# EasyEDA Pro project ProPrj_智能环境监测节点与设计_2026-04-18.epro

# Schematic Schematic1
Assembly Variant: Basic; Board Name: Board1; Create Date: 2026-04-17; Page Name: P1; Project Name: 智能环境监测节点与设计; Schematic Name: Schematic1; Update Date: 2026-04-17; BladeWidth: 10; Company: 嘉立创EDA; Page Size: A4; RegionStart: 1; ShowBorder: 1; TitleBlock: 1; TitleBlockPosition: 3; Version: V1.0; XRegionCount: 6; YRegionCount: 4
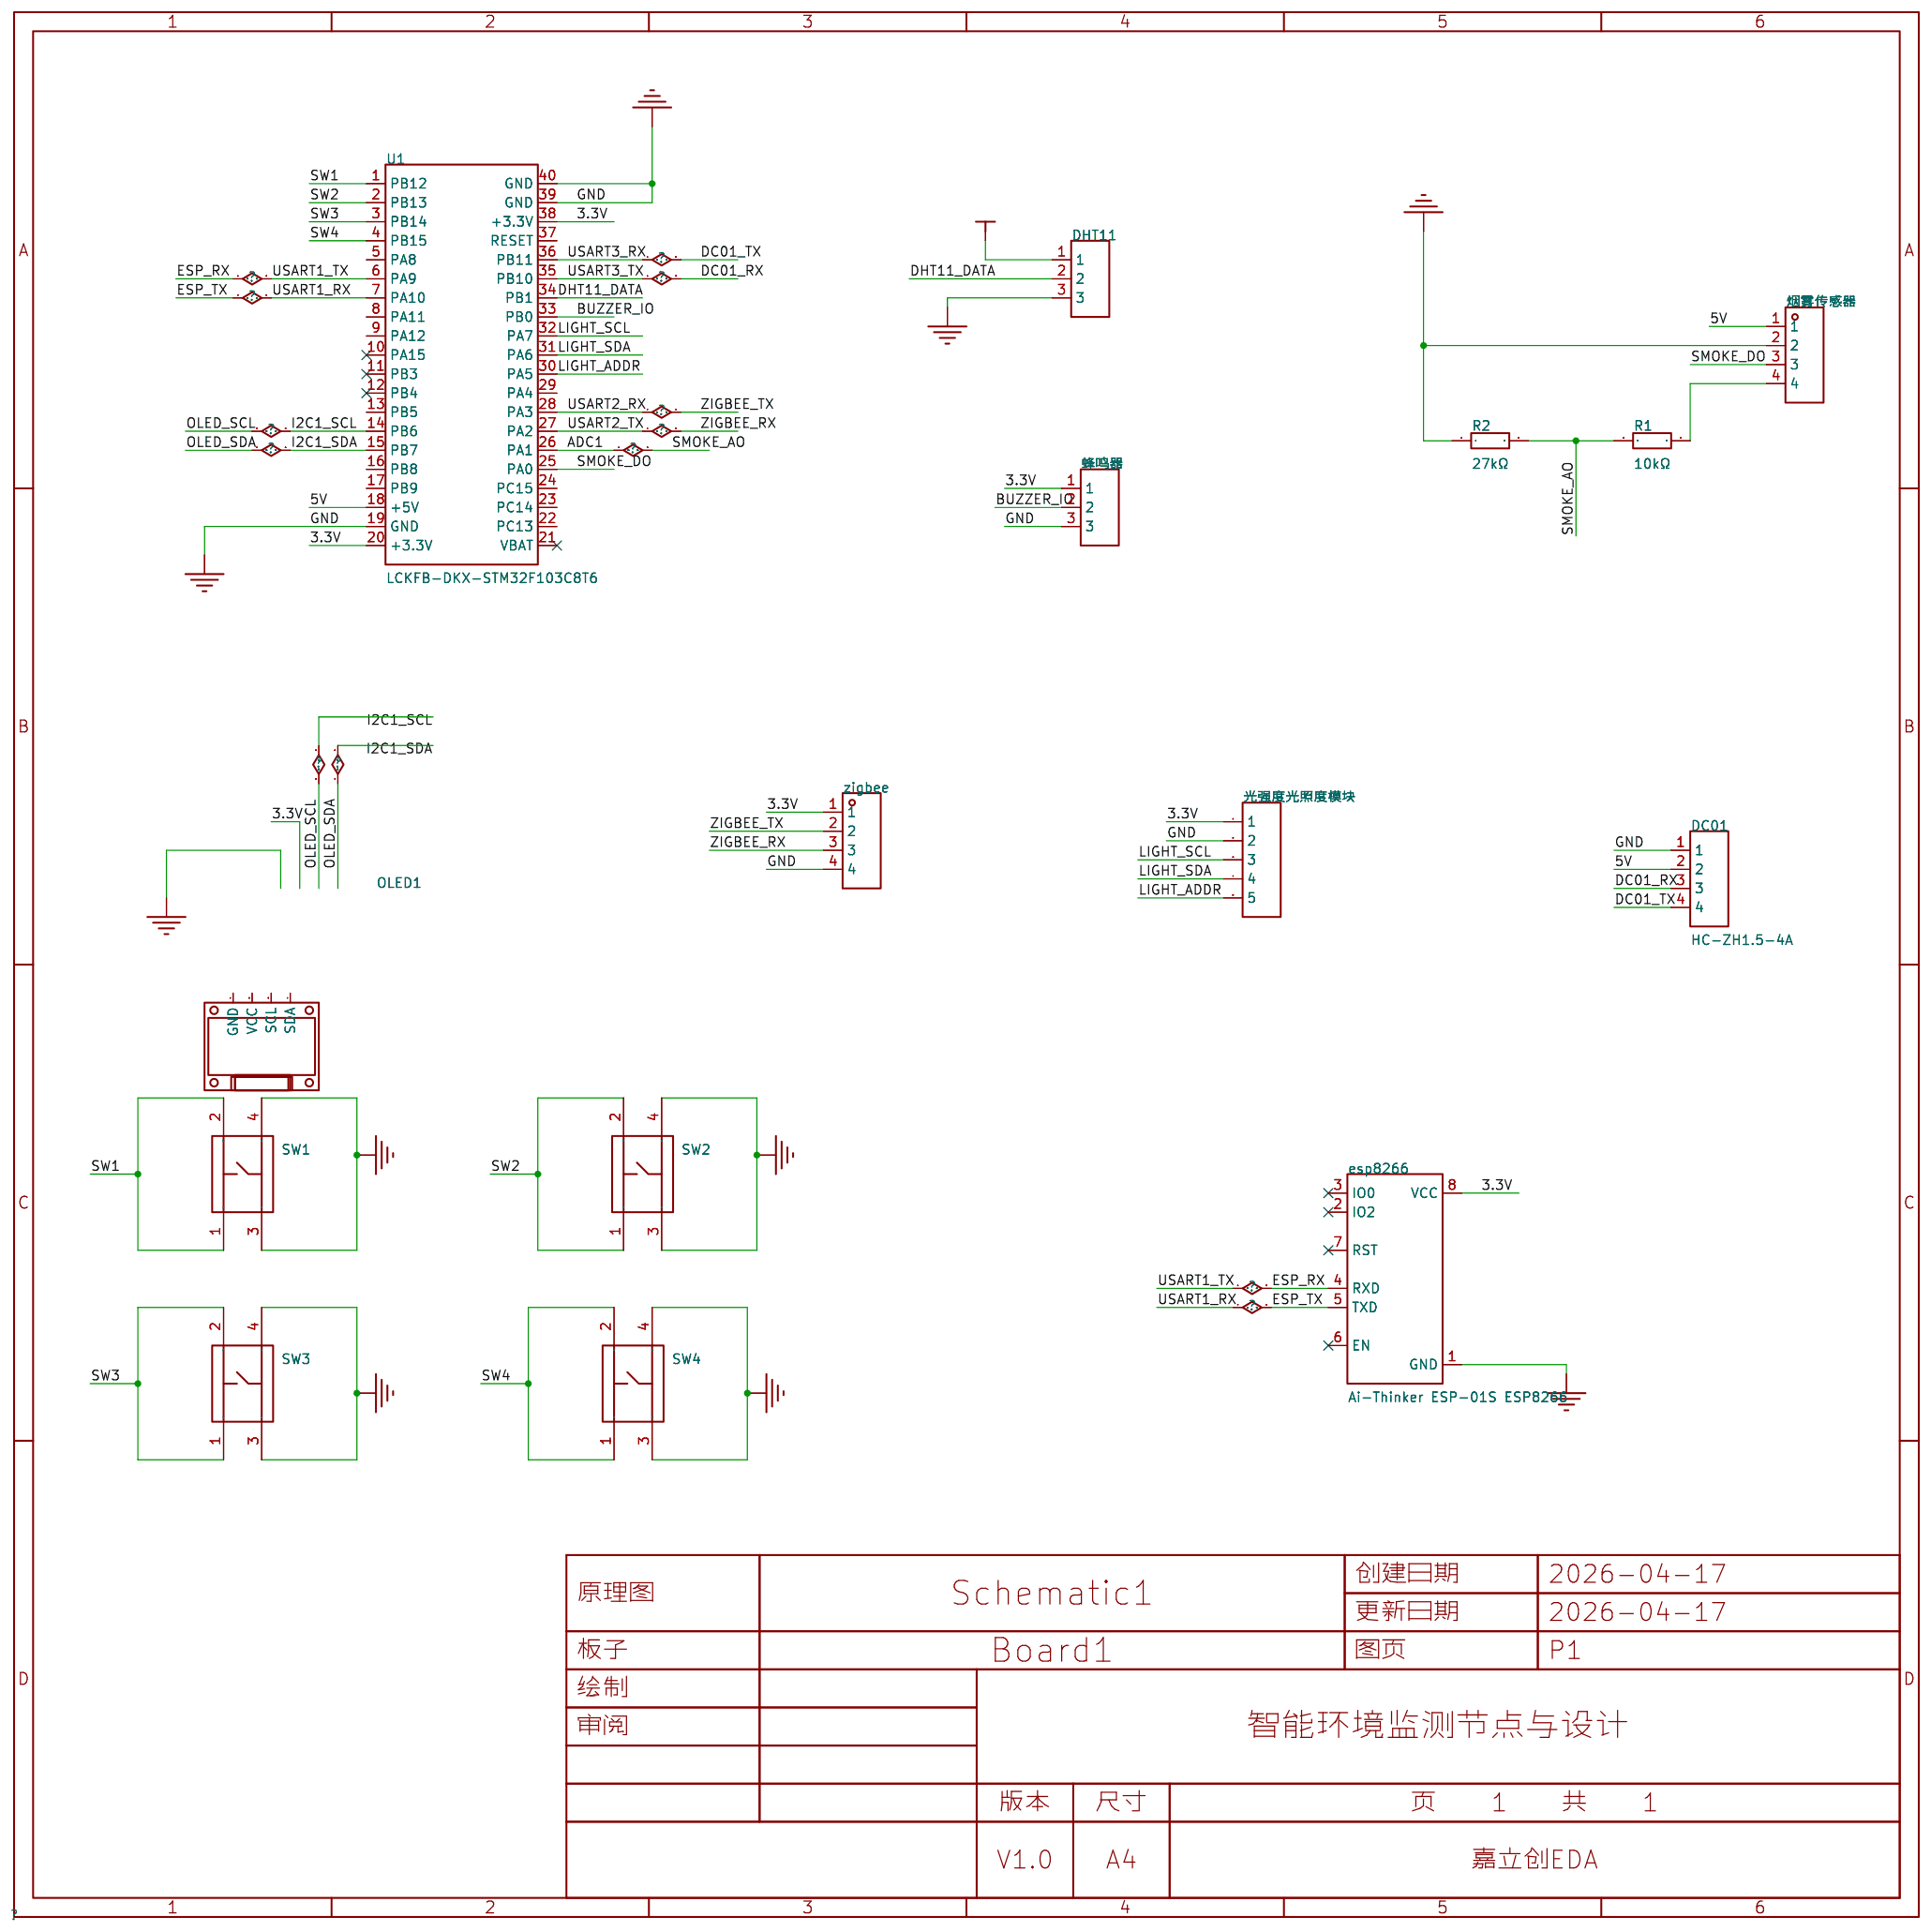
[diagram p0: schematic sheet]

## Parts
DC01  HC-ZH1.5-4A  [CONN-TH_4P-P1.50_HCTL_HC-ZH1.5-4A]
DHT11  -  [HDR-TH_3P-P2.54-V-F]
esp8266  Ai-Thinker ESP-01S ESP8266  [WIFIM-TH_8P-L24.7-W14.4-P2.54]
OLED1  -  [0.96OLED_4P]
R1  10kΩ  [R0805]
R2  27kΩ  [R0805]
SW1  K2-1102DP-C4SW-04  [KEY-TH_4P-L6.0-W6.0-P4.50-LS6.50]
SW2  K2-1102DP-C4SW-04  [KEY-TH_4P-L6.0-W6.0-P4.50-LS6.50]
SW3  K2-1102DP-C4SW-04  [KEY-TH_4P-L6.0-W6.0-P4.50-LS6.50]
SW4  K2-1102DP-C4SW-04  [KEY-TH_4P-L6.0-W6.0-P4.50-LS6.50]
U1  LCKFB-DKX-STM32F103C8T6  [CONN-TH_L53.3-W22.9_STM32F103C8T6-CARD]
zigbee  -  [HDR-TH_4P-P2.54-V-F]
光强度光照度模块  -  [HDR-TH_5P-P2.54-V-F]
烟雾传感器  -  [HDR-TH_4P-P2.54-V-F]
蜂鸣器  -  [HDR-TH_3P-P2.54-V-F]

## Library data of the parts
DC01 = HC-ZH1.5-4A: 插针结构:1x4P;间距:1.5mm;安装方式:直插;参考系列:ZH;总PIN数:4P;排数:1;每排PIN数:4;行距:-;额定电流:1A;触头材质:黄铜;触头镀层:锡;工作温度:-25℃~+85℃;; LCSC Part Name: 1x4P 间距:1.5mm 直插 系列:ZH; Supplier Part: C2845552; Manufacturer: HCTL(华灿天禄); Supplier Footprint: 插件,P=1.5mm; JLCPCB Part Class: Extended Part; Datasheet: https://item.szlcsc.com/datasheet/HC-ZH1.5-4A/3039233.html; Supplier: LCSC; Pins Structure: 1x4P; Pitch: 1.5mm; Mounting Type: 直插; Reference Series: ZH; Number of Pins: 4P; Number of Rows: 1; Number of PINs Per Row: 4; Current Rating: 1A; Contact Material: 黄铜; Contact Plating: 锡; Operating Temperature: -25℃~+85℃; Voltage Rating: 100V; Plastic Material: PBT; Flame Retardant Rating: UL94V-0; Z-Height of the Board: 4.5mm; X-Length of Bottom Edge on Board (Spacing Line): 7.5mm; Y-Width of Bottom Edge on Board: 3.6mm
DHT11 蜂鸣器 = HDR-F_2.54_1x3P: Supplier Part: C541850; Supplier Footprint: 插件
esp8266 = Ai-Thinker ESP-01S ESP8266: Supplier Part: C17606792; Manufacturer: Ai-Thinker(安信可); JLCPCB Part Class: Extended Part; Datasheet: https://item.szlcsc.com/datasheet/Ai-Thinker%2520ESP-01S%2520ESP8266/18736031.html; Supplier: LCSC
OLED1 = 0.96OLED模块_4P: Supplier Footprint: 插件
R1 R2 = 0805W8F1002T5E_C17414: 电阻类型:厚膜电阻;阻值:10kΩ;精度:±1%;功率:125mW;工作电压:150V;温度系数:±100ppm/℃;; LCSC Part Name: 10kΩ ±1% 125mW 厚膜电阻; Supplier Part: C17414; Manufacturer: UNI-ROYAL(厚声); Manufacturer Part: 0805W8F1002T5E; Supplier Footprint: 0805; JLCPCB Part Class: Basic Part; Datasheet: https://item.szlcsc.com/datasheet/0805W8F1002T5E/18102.html; Supplier: LCSC; Type: 厚膜电阻; Tolerance: ±1%; Power(Watts): 125mW; Voltage-Supply(Max): 150V; Temperature Coefficient: ±100ppm/℃; Operating Temperature: -55℃~+155℃
SW1-SW4 = K2-1102DP-C4SW-04: 电路结构:单刀单掷;按钮形状:圆形按钮;作用力:2.5N;安装方式:直插;开关长度:6mm;开关宽度:6mm;开关高度:5mm;触点电流:50mA;额定电压:12V;带灯:-;工作寿命:10万次;; LCSC Part Name: 轻触按键开关6*6*5; Supplier Part: C110153; Manufacturer: 韩国韩荣; Supplier Footprint: 插件-4P,6x6mm; JLCPCB Part Class: Extended Part; Datasheet: https://item.szlcsc.com/datasheet/K2-1102DP-C4SW-04/111374.html; Supplier: LCSC; Circuit: 单刀单掷; Actuator Style: 圆形按钮; Operating Force: 2.5N; Mounting Type: 直插; Length: 6mm; Width: 6mm; Switch Height: 5mm; Contact Current: 50mA; Voltage Rating: 12V; Life: 10万次; Operating Temperature: -25℃~+85℃
U1 = LCKFB-DKX-STM32F103C8T6: 搭载Contex M3内核,程序存储容量64KB,RAM总容量20KB,最高72MHz主频,提供高效的计算能力和稳定的运行环境。; LCSC Part Name: 立创·地阔星-STM32F103C8T6开发板; Supplier Part: C22396880; Manufacturer: 立创开发板; JLCPCB Part Class: Extended Part; Datasheet: https://item.szlcsc.com/datasheet/LCKFB-DKX-STM32F103C8T6/24005615.html; Supplier: LCSC
zigbee 烟雾传感器 = HDR-F_2.54_1x4P: Supplier Part: C2718488; Supplier Footprint: 插件
光强度光照度模块 = HDR-F_2.54_1x5P: Supplier Part: C50950; Supplier Footprint: 插件

## Nets
3.3V: DHT11.1 esp8266.8(VCC) U1.20(+3.3V) U1.38(+3.3V) zigbee.1 光强度光照度模块.1 蜂鸣器.1
5V: DC01.2 U1.18(+5V) 烟雾传感器.1
GND: DC01.1 DHT11.3 esp8266.1(GND) R2.1 SW1.3 SW1.4 SW2.3 SW2.4 SW3.3 SW3.4 SW4.3 SW4.4 U1.19(GND) U1.39(GND) U1.40(GND) zigbee.4 光强度光照度模块.2 烟雾传感器.2 蜂鸣器.3
ADC1: R1.1 R2.2 U1.26(PA1)
BUZZER_IO: U1.33(PB0) 蜂鸣器.2
DC01_RX: DC01.3 U1.35(PB10)
DC01_TX: DC01.4 U1.36(PB11)
DHT11_DATA: DHT11.2 U1.34(PB1)
ESP_RX: esp8266.4(RXD) U1.6(PA9)
ESP_TX: esp8266.5(TXD) U1.7(PA10)
I2C1_SCL: U1.14(PB6)
I2C1_SDA: U1.15(PB7)
LIGHT_ADDR: U1.30(PA5) 光强度光照度模块.5
LIGHT_SCL: U1.32(PA7) 光强度光照度模块.3
LIGHT_SDA: U1.31(PA6) 光强度光照度模块.4
SMOKE_DO: U1.25(PA0) 烟雾传感器.3
SW1: SW1.1 SW1.2 U1.1(PB12)
SW2: SW2.1 SW2.2 U1.2(PB13)
SW3: SW3.1 SW3.2 U1.3(PB14)
SW4: SW4.1 SW4.2 U1.4(PB15)
USART2_RX: U1.28(PA3) zigbee.2
USART2_TX: U1.27(PA2) zigbee.3
$1N46: R1.2 烟雾传感器.4

Not connected (* = marked no-connect by the designer): esp8266 2(IO2)* 3(IO0)* 6(EN)* 7(RST)*; OLED1 1(GND) 2(VCC) 3(SCL) 4(SDA); U1 5(PA8) 8(PA11) 9(PA12) 10(PA15)* 11(PB3)* 12(PB4)* 13(PB5) 16(PB8) 17(PB9) 21(VBAT)* 22(PC13) 23(PC14) 24(PC15) 29(PA4) 37(RESET)

# Board PCB1
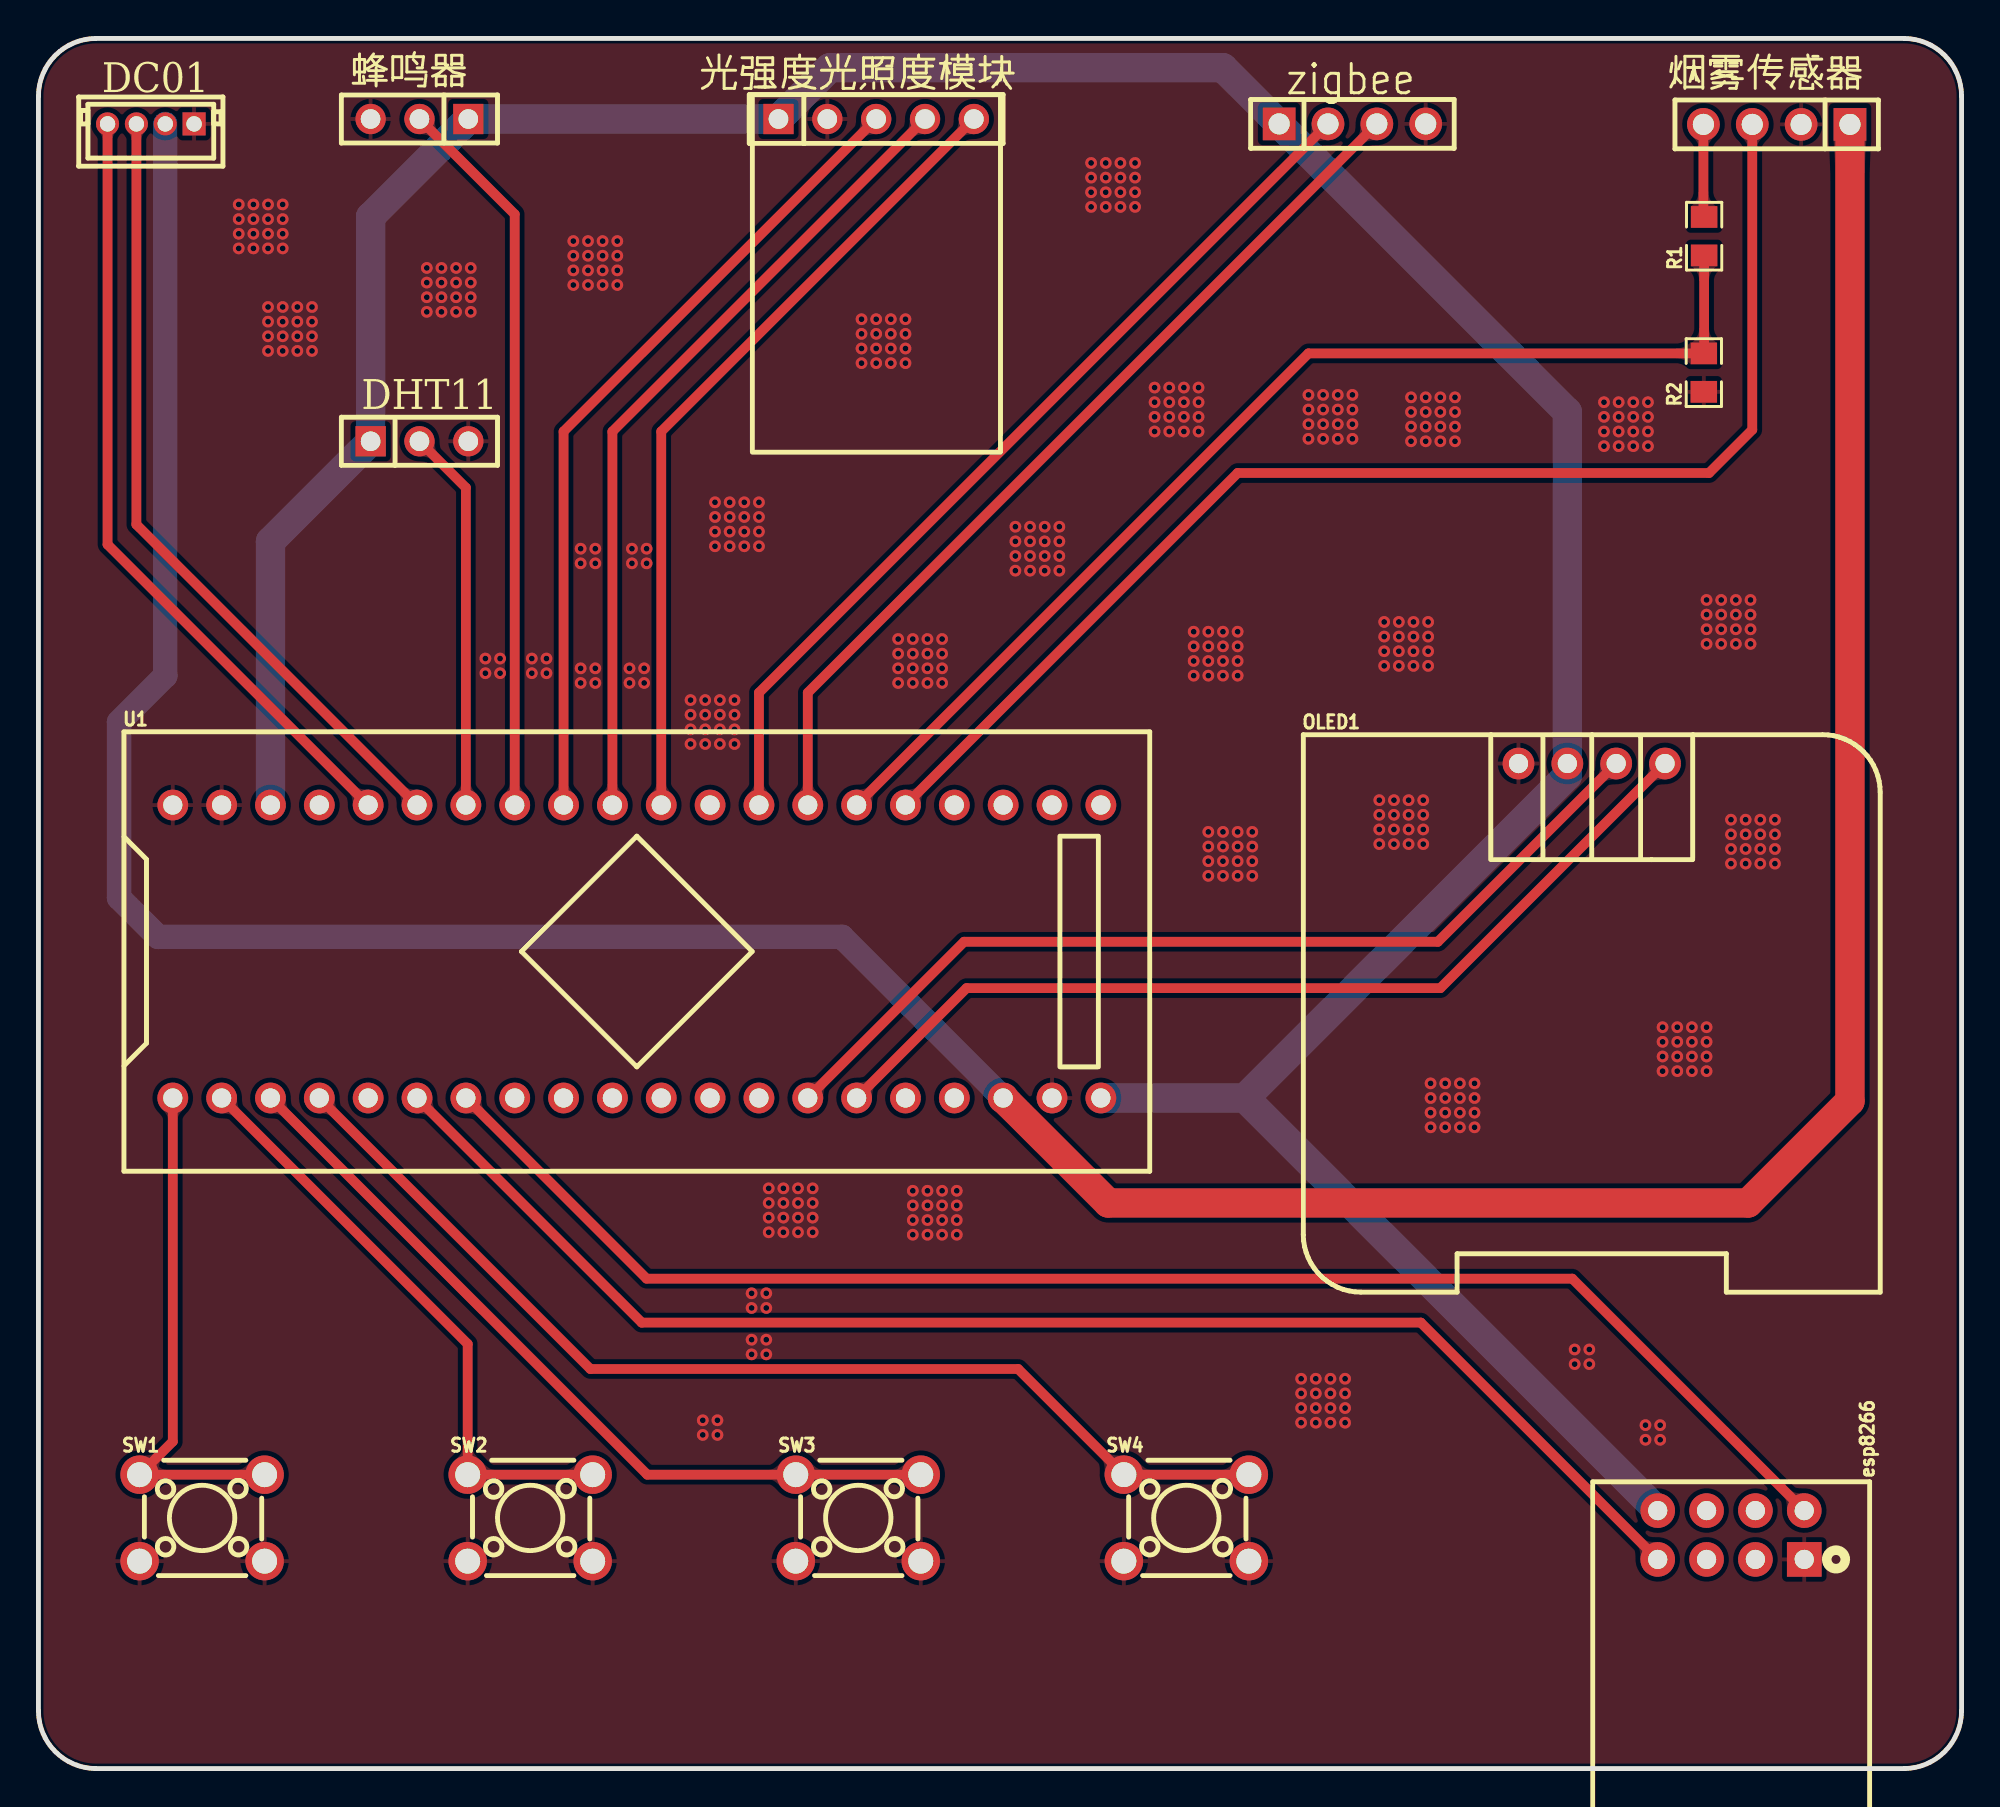
[diagram p1: board, top side]
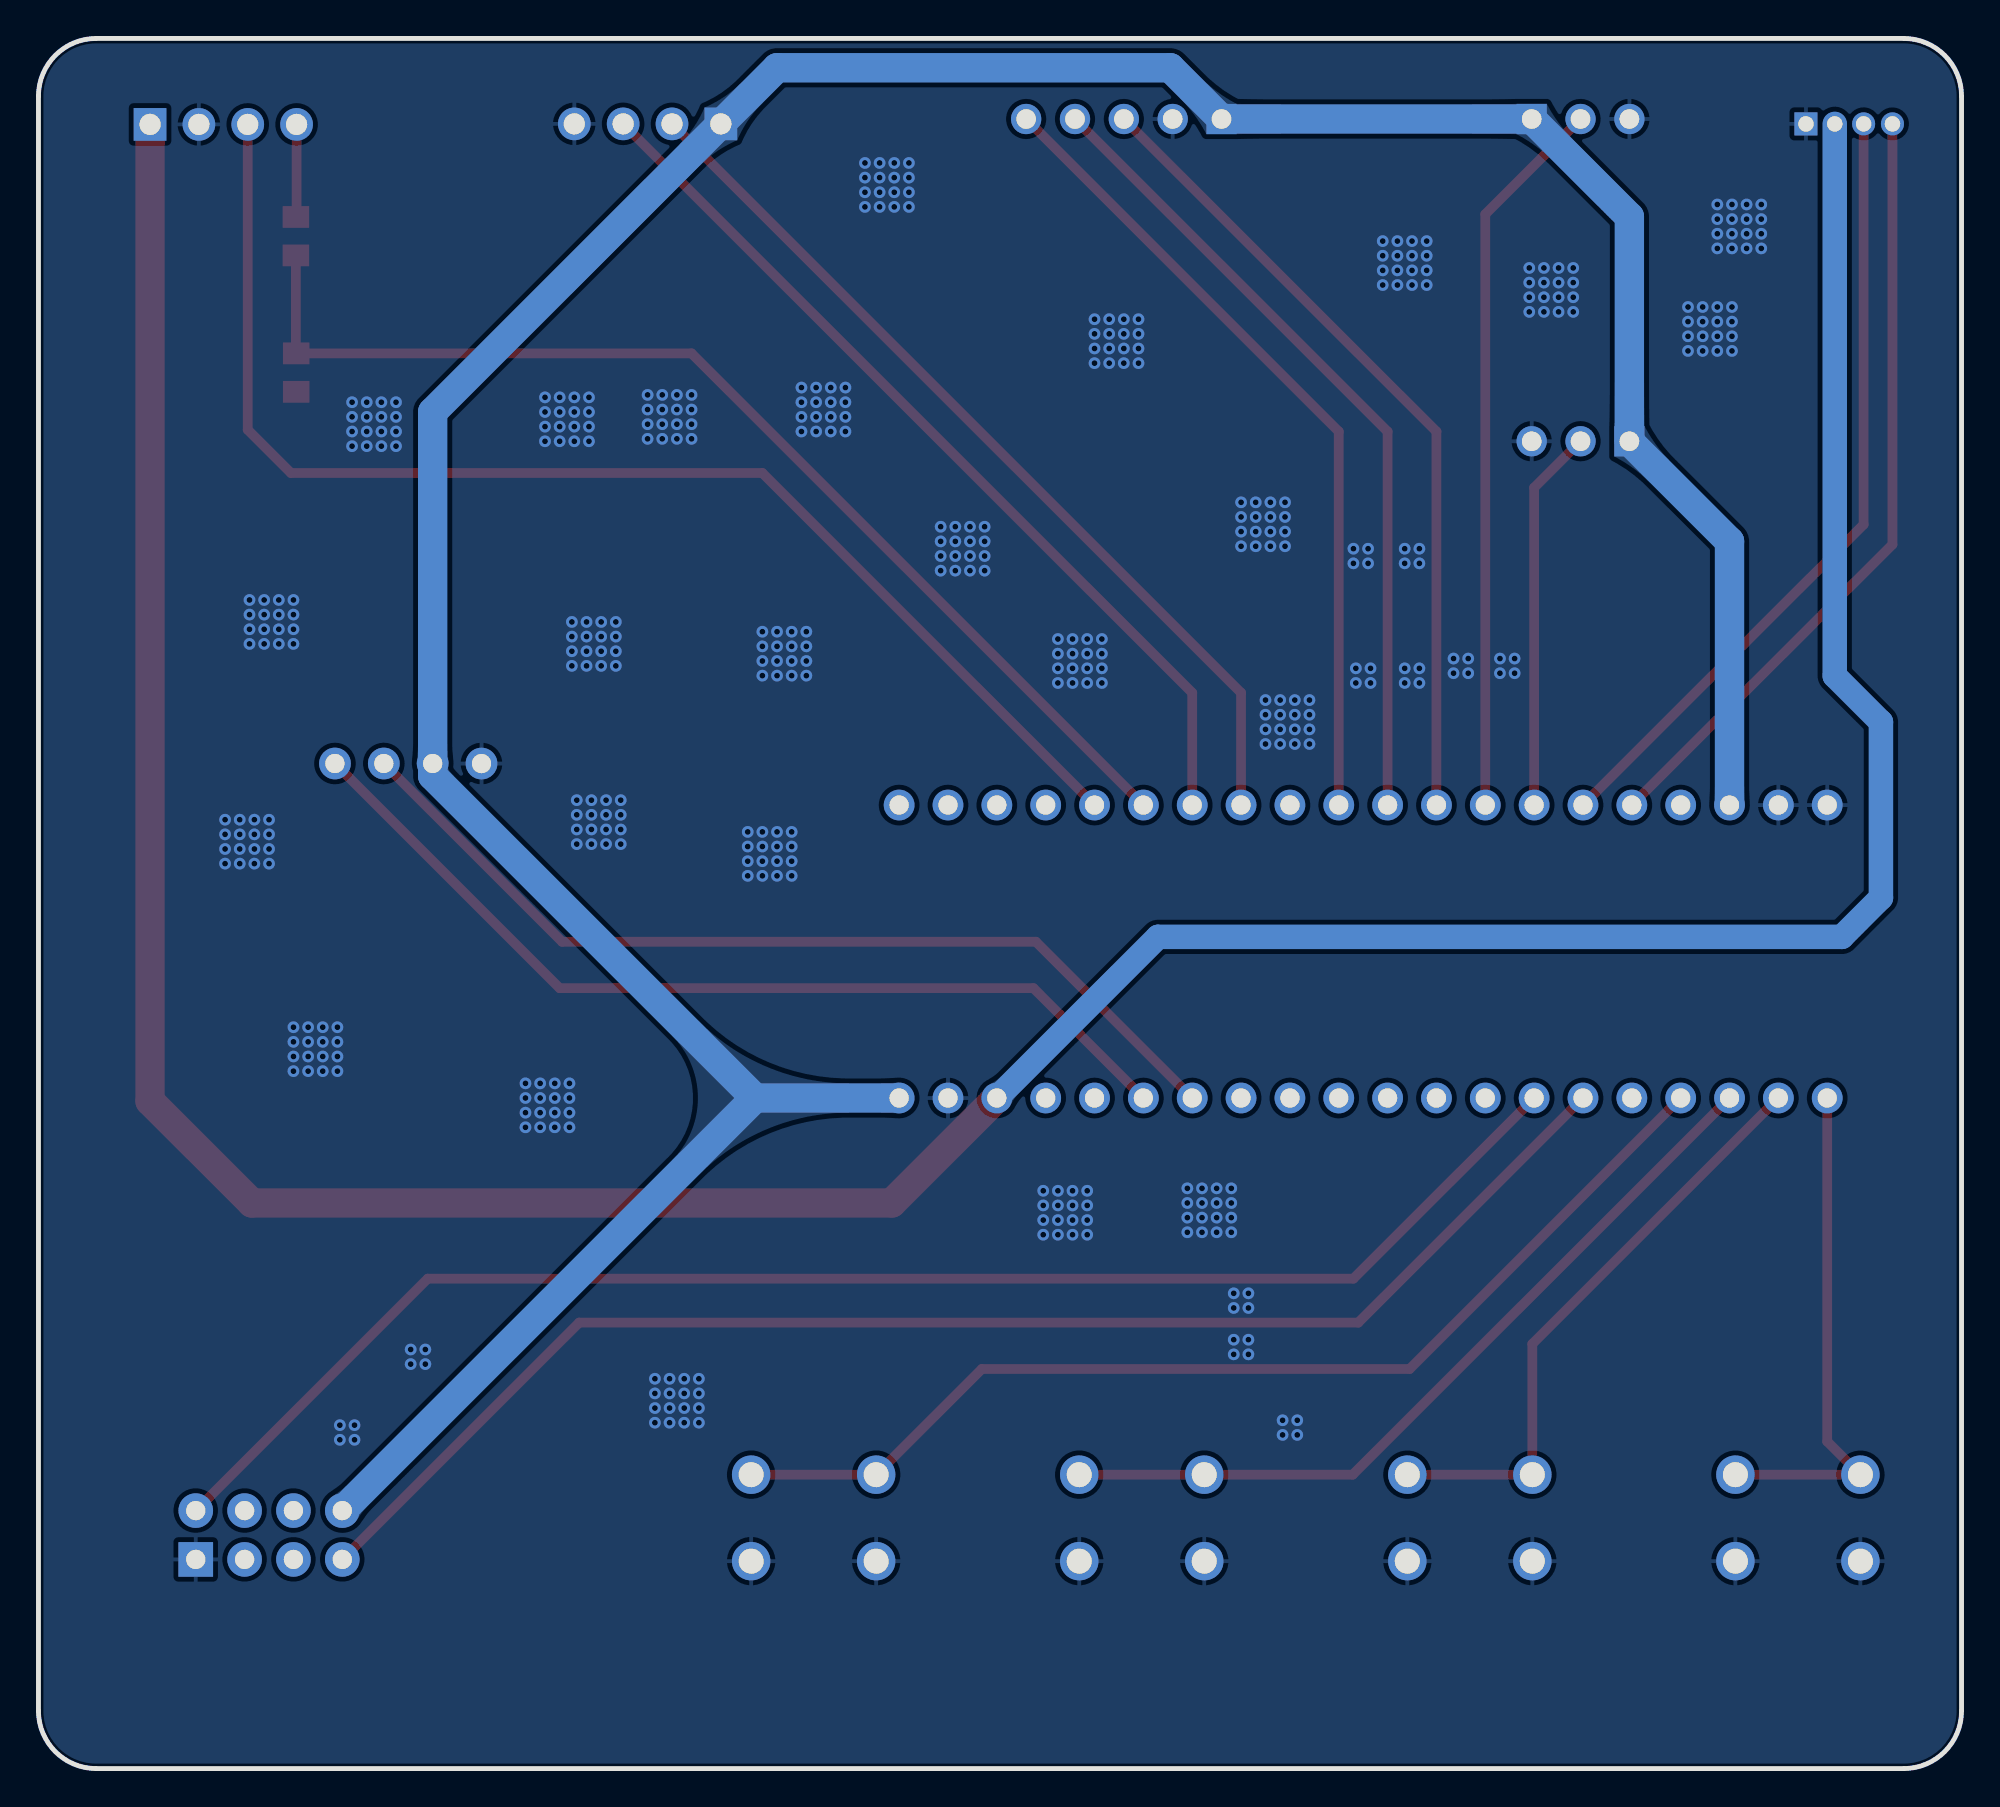
[diagram p2: board, bottom side, seen from below]

Outline 100 x 90 mm; copper layers: Top Layer, Bottom Layer. Coordinates in mm from the lower left corner of the outline.
Outline path: 0,87 0,3 arc(0.88,0.88) 3,0 97,0 arc(99.12,0.88) 100,3 100,87 arc(99.12,89.12) 97,90 3,90 arc(0.88,89.12) 0,87
Stack: Top Layer 0.035mm / Dielectric1 1.51mm FR4 er 4.5 / Bottom Layer 0.035mm

## Design rules (mm)
spacing copperThickness1oz (default): track to track 0.102, other pairs 0.152 to 0.3
spacing copperThickness2oz: track to track 0.203, other pairs 0.152 to 0.3
track width copperThickness1oz (default): min 0.127, default 0.254, max 2.54
track width copperThickness2oz: min 0.203, default 0.254, max 2.54
differential pair differentialPair (default): width min 0.127, default 0.254, max 2.54; gap min 0.152, default 0.152
net GND uses copperRegion

## Placement (name value [footprint] x y rotation side)
DC01  HC-ZH1.5-4A  [CONN-TH_4P-P1.50_HCTL_HC-ZH1.5-4A]  5.84 85.56 180 top
DHT11  -  [HDR-TH_3P-P2.54-V-F]  19.81 69.05 0 top
esp8266  Ai-Thinker ESP-01S ESP8266  [WIFIM-TH_8P-L24.7-W14.4-P2.54]  88.01 12.15 270 top
OLED1  -  [0.96OLED_4P]  80.77 52.28 0 top
R1  10kΩ  [R0805]  86.61 79.71 90 top
R2  27kΩ  [R0805]  86.6 72.62 90 top
SW1  K2-1102DP-C4SW-04  [KEY-TH_4P-L6.0-W6.0-P4.50-LS6.50]  8.51 13.04 0 top
SW2  K2-1102DP-C4SW-04  [KEY-TH_4P-L6.0-W6.0-P4.50-LS6.50]  25.57 13.04 0 top
SW3  K2-1102DP-C4SW-04  [KEY-TH_4P-L6.0-W6.0-P4.50-LS6.50]  42.63 13.04 0 top
SW4  K2-1102DP-C4SW-04  [KEY-TH_4P-L6.0-W6.0-P4.50-LS6.50]  59.69 13.04 0 top
U1  LCKFB-DKX-STM32F103C8T6  [CONN-TH_L53.3-W22.9_STM32F103C8T6-CARD]  31.12 42.5 0 top
zigbee  -  [HDR-TH_4P-P2.54-V-F]  68.33 85.56 0 top
光强度光照度模块  -  [HDR-TH_5P-P2.54-V-F]  43.56 85.81 0 top
烟雾传感器  -  [HDR-TH_4P-P2.54-V-F]  90.39 85.53 180 top
蜂鸣器  -  [HDR-TH_3P-P2.54-V-F]  19.81 85.81 180 top

## Footprints (pads in the part's own frame, mm; a bottom-side part is the same pattern mirrored in y, then rotated)
0.96OLED_4P
  round 1.65 hole 1: 1(-3.81,-0.002) 2(-1.27,0.002) 3(1.27,0.002) 4(3.81,0.002)
CONN-TH_4P-P1.50_HCTL_HC-ZH1.5-4A
  rect 1.2x1.2 hole 0.8: 1(-2.25,0)
  round 1.2 hole 0.8: 2(-0.75,0) 3(0.75,0) 4(2.25,0)
CONN-TH_L53.3-W22.9_STM32F103C8T6-CARD
  round 1.6 hole 1: 1(-24.13,-7.62) 2(-21.59,-7.62) 3(-19.05,-7.62) 4(-16.51,-7.62) 5(-13.97,-7.62) 6(-11.43,-7.62) 7(-8.89,-7.62) 8(-6.35,-7.62) 9(-3.81,-7.62) 10(-1.27,-7.62) 11(1.27,-7.62) 12(3.81,-7.62) 13(6.35,-7.62) 14(8.89,-7.62) 15(11.43,-7.62) 16(13.97,-7.62) 17(16.51,-7.62) 18(19.05,-7.62) 19(21.59,-7.62) 20(24.13,-7.62) 21(24.13,7.62) 22(21.59,7.62) 23(19.05,7.62) 24(16.51,7.62) 25(13.97,7.62) 26(11.43,7.62) 27(8.89,7.62) 28(6.35,7.62) 29(3.81,7.62) 30(1.27,7.62) 31(-1.27,7.62) 32(-3.81,7.62) 33(-6.35,7.62) 34(-8.89,7.62) 35(-11.43,7.62) 36(-13.97,7.62) 37(-16.51,7.62) 38(-19.05,7.62) 39(-21.59,7.62) 40(-24.13,7.62)
HDR-TH_3P-P2.54-V-F
  rect 1.575x1.575 hole 1.02: 1(-2.54,0)
  round 1.575 hole 1.02: 2(0,0) 3(2.54,0)
HDR-TH_4P-P2.54-V-F
  rect 1.7x1.7 hole 1.1: 1(-3.81,0)
  round 1.7 hole 1.1: 2(-1.27,0) 3(1.27,0) 4(3.81,0)
HDR-TH_5P-P2.54-V-F
  rect 1.575x1.575 hole 1.02: 1(-5.08,0)
  round 1.575 hole 1.02: 2(-2.54,0) 3(0,0) 4(2.54,0) 5(5.08,0)
KEY-TH_4P-L6.0-W6.0-P4.50-LS6.50
  round 2 hole 1.3: 1(-3.25,2.25) 2(3.25,2.25) 3(-3.25,-2.25) 4(3.25,-2.25)
R0805
  rect 1.133x1.377 smd: 1(-1,0) 2(1,0)
WIFIM-TH_8P-L24.7-W14.4-P2.54
  rect 1.8x1.8 hole 1: 1(1.27,3.81)
  round 1.8 hole 1: 2(1.27,1.27) 3(1.27,-1.27) 4(1.27,-3.81) 5(-1.27,3.81) 6(-1.27,1.27) 7(-1.27,-1.27) 8(-1.27,-3.81)

## Nets
As in the schematic, except:
3.3V: DHT11.1 esp8266.8 OLED1.2 U1.20 U1.38 zigbee.1 光强度光照度模块.1 蜂鸣器.1
GND: DC01.1 DHT11.3 esp8266.1 OLED1.1 R2.1 SW1.3 SW1.4 SW2.3 SW2.4 SW3.3 SW3.4 SW4.3 SW4.4 U1.19 U1.39 U1.40 zigbee.4 光强度光照度模块.2 烟雾传感器.2 蜂鸣器.3
I2C1_SCL: OLED1.3 U1.14
I2C1_SDA: OLED1.4 U1.15

Pads without a net: esp8266 2 3 6 7; U1 5 8 9 10 11 12 13 16 17 21 22 23 24 29 37

## Via types
v1: diameter 0.61, hole 0.305, Top Layer to Bottom Layer, 444 vias

## Routing (per net, layer and track width the routed paths; a pad name or vN(x,y) marks a point on that pad's centre or on a via; arc(x,y) is an arc through that point)
3.3V: length 186.1
  Bottom Layer w1.524: U1.20 62.74,34.88 ; 62.74,34.88 79.5,51.65 OLED1.2 79.5,70.57 zigbee.1 61.59,88.48 41.15,88.48 光强度光照度模块.1 蜂鸣器.1 17.27,80.73 DHT11.1 12.06,63.84 12.06,50.12 ; 62.74,34.88 esp8266.8
5V: length 190.8
  Top Layer w1.524: 烟雾传感器.1 94.2,34.72 88.9,29.42 55.63,29.42 50.16,34.88
  Bottom Layer w1.27: DC01.2 6.59,56.84 4.19,54.44 4.19,45.3 6.22,43.26 41.78,43.26 50.16,34.88
GND:
  vias: v1(10.41,81.36) v1(10.41,80.6) v1(10.41,79.84) v1(10.41,79.08) v1(11.18,81.36) v1(11.18,80.6) v1(11.18,79.84) v1(11.18,79.08) v1(11.94,81.36) v1(11.94,80.6) v1(11.94,79.84) v1(11.94,79.08) v1(11.94,76.03) v1(11.94,75.27) v1(11.94,74.51) v1(11.94,73.74) v1(12.7,81.36) v1(12.7,80.6) v1(12.7,79.84) v1(12.7,79.08) v1(12.7,76.03) v1(12.7,75.27) v1(12.7,74.51) v1(12.7,73.74) v1(13.46,76.03) v1(13.46,75.27) v1(13.46,74.51) v1(13.46,73.74) v1(14.22,76.03) v1(14.22,75.27) v1(14.22,74.51) v1(14.22,73.74) v1(20.19,78.06) v1(20.19,77.3) v1(20.19,76.54) v1(20.19,75.78) v1(20.95,78.06) v1(20.96,77.3) v1(20.95,76.54) v1(20.96,75.78) v1(21.72,78.06) v1(21.72,77.3) v1(21.72,76.54) v1(21.72,75.78) v1(22.48,78.06) v1(22.48,77.3) v1(22.48,76.54) v1(22.48,75.78) v1(23.24,57.74) v1(23.24,56.98) v1(24,57.74) v1(24,56.98) v1(25.65,57.74) v1(25.65,56.98) v1(26.42,57.74) v1(26.42,56.98) v1(27.81,79.46) v1(27.81,78.7) v1(27.81,77.94) v1(27.81,77.17) v1(28.19,63.46) v1(28.19,62.69) v1(28.19,57.23) v1(28.19,56.47) v1(28.57,79.46) v1(28.58,78.7) v1(28.57,77.94) v1(28.58,77.17) v1(28.96,63.46) v1(28.96,62.69) v1(28.96,57.23) v1(28.96,56.47) v1(29.34,79.46) v1(29.34,78.7) v1(29.34,77.94) v1(29.34,77.17) v1(30.1,79.46) v1(30.1,78.7) v1(30.1,77.94) v1(30.1,77.17) v1(30.73,57.23) v1(30.73,56.47) v1(30.86,63.46) v1(30.86,62.69) v1(31.5,57.23) v1(31.5,56.47) v1(31.62,63.46) v1(31.62,62.69) v1(33.91,55.58) v1(33.91,54.82) v1(33.91,54.06) v1(33.91,53.3) v1(34.54,18.12) v1(34.54,17.36) v1(34.67,55.58) v1(34.67,54.82) v1(34.67,54.06) v1(34.67,53.3) v1(35.18,65.87) v1(35.18,65.11) v1(35.18,64.35) v1(35.18,63.58) v1(35.31,18.12) v1(35.31,17.36) v1(35.43,55.58) v1(35.43,54.82) v1(35.43,54.06) v1(35.43,53.3) v1(35.94,65.87) v1(35.94,65.11) v1(35.94,64.35) v1(35.94,63.58) v1(36.19,55.58) v1(36.2,54.82) v1(36.19,54.06) v1(36.2,53.3) v1(36.7,65.87) v1(36.7,65.11) v1(36.7,64.35) v1(36.7,63.58) v1(37.08,24.72) v1(37.08,23.96) v1(37.08,22.31) v1(37.08,21.55) v1(37.46,65.87) v1(37.47,65.11) v1(37.46,64.35) v1(37.47,63.58) v1(37.85,24.72) v1(37.85,23.96) v1(37.85,22.31) v1(37.85,21.55) v1(37.97,30.18) v1(37.97,29.42) v1(37.97,28.66) v1(37.97,27.9) v1(38.74,30.18) v1(38.74,29.42) v1(38.73,28.66) v1(38.74,27.9) v1(39.5,30.18) v1(39.5,29.42) v1(39.5,28.66) v1(39.5,27.9) v1(40.26,30.18) v1(40.26,29.42) v1(40.26,28.66) v1(40.26,27.9) v1(42.8,75.39) v1(42.8,74.63) v1(42.8,73.87) v1(42.8,73.11) v1(43.56,75.39) v1(43.56,74.63) v1(43.56,73.87) v1(43.56,73.11) v1(44.32,75.39) v1(44.32,74.63) v1(44.32,73.87) v1(44.32,73.11) v1(44.7,58.76) v1(44.7,58) v1(44.7,57.23) v1(44.7,56.47) v1(45.08,75.39) v1(45.09,74.63) v1(45.08,73.87) v1(45.09,73.11) v1(45.47,58.76) v1(45.47,58) v1(45.47,57.23) v1(45.47,56.47) v1(45.47,30.06) v1(45.47,29.29) v1(45.47,28.53) v1(45.47,27.77) v1(46.23,58.76) v1(46.23,58) v1(46.23,57.23) v1(46.23,56.47) v1(46.23,30.06) v1(46.23,29.29) v1(46.23,28.53) v1(46.23,27.77) v1(46.99,58.76) v1(46.99,58) v1(46.99,57.23) v1(46.99,56.47) v1(46.99,30.06) v1(46.99,29.29) v1(46.99,28.53) v1(46.99,27.77) v1(47.75,30.06) v1(47.75,29.29) v1(47.75,28.53) v1(47.75,27.77) v1(50.8,64.6) v1(50.8,63.84) v1(50.8,63.08) v1(50.8,62.31) v1(51.56,64.6) v1(51.56,63.84) v1(51.56,63.08) v1(51.56,62.31) v1(52.32,64.6) v1(52.32,63.84) v1(52.32,63.08) v1(52.32,62.31) v1(53.09,64.6) v1(53.09,63.84) v1(53.09,63.08) v1(53.09,62.31) v1(54.74,83.52) v1(54.74,82.76) v1(54.74,82) v1(54.74,81.24) v1(55.5,83.52) v1(55.5,82.76) v1(55.5,82) v1(55.5,81.24) v1(56.26,83.52) v1(56.26,82.76) v1(56.26,82) v1(56.26,81.24) v1(57.02,83.52) v1(57.02,82.76) v1(57.02,82) v1(57.02,81.24) v1(58.04,71.84) v1(58.04,71.08) v1(58.04,70.31) v1(58.04,69.55) v1(58.8,71.84) v1(58.8,71.08) v1(58.8,70.31) v1(58.8,69.55) v1(59.56,71.84) v1(59.56,71.08) v1(59.56,70.31) v1(59.56,69.55) v1(60.07,59.14) v1(60.07,58.38) v1(60.07,57.61) v1(60.07,56.85) v1(60.32,71.84) v1(60.33,71.08) v1(60.32,70.31) v1(60.33,69.55) v1(60.83,59.14) v1(60.83,58.38) v1(60.83,57.61) v1(60.83,56.85) v1(60.83,48.72) v1(60.83,47.96) v1(60.83,47.2) v1(60.83,46.44) v1(61.59,59.14) v1(61.59,58.38) v1(61.59,57.61) v1(61.59,56.85) v1(61.59,48.72) v1(61.6,47.96) v1(61.59,47.2) v1(61.6,46.44) v1(62.36,59.14) v1(62.36,58.38) v1(62.36,57.61) v1(62.36,56.85) v1(62.36,48.72) v1(62.36,47.96) v1(62.36,47.2) v1(62.36,46.44) v1(63.12,48.72) v1(63.12,47.96) v1(63.12,47.2) v1(63.12,46.44) v1(65.66,20.28) v1(65.66,19.51) v1(65.66,18.75) v1(65.66,17.99) v1(66.04,71.46) v1(66.04,70.7) v1(66.04,69.93) v1(66.04,69.17) v1(66.42,20.28) v1(66.42,19.51) v1(66.42,18.75) v1(66.42,17.99) v1(66.8,71.46) v1(66.8,70.7) v1(66.8,69.93) v1(66.8,69.17) v1(67.18,20.28) v1(67.18,19.51) v1(67.18,18.75) v1(67.18,17.99) v1(67.56,71.46) v1(67.56,70.7) v1(67.56,69.93) v1(67.56,69.17) v1(67.94,20.28) v1(67.95,19.51) v1(67.94,18.75) v1(67.95,17.99) v1(68.33,71.46) v1(68.33,70.7) v1(68.33,69.93) v1(68.33,69.17) v1(69.72,50.38) v1(69.72,49.61) v1(69.72,48.85) v1(69.72,48.09) v1(69.98,59.65) v1(69.98,58.89) v1(69.98,58.12) v1(69.98,57.36) v1(70.49,50.38) v1(70.49,49.61) v1(70.48,48.85) v1(70.49,48.09) v1(70.74,59.65) v1(70.74,58.89) v1(70.74,58.12) v1(70.74,57.36) v1(71.25,50.38) v1(71.25,49.61) v1(71.25,48.85) v1(71.25,48.09) v1(71.37,71.33) v1(71.37,70.57) v1(71.37,69.81) v1(71.37,69.05) v1(71.5,59.65) v1(71.5,58.89) v1(71.5,58.12) v1(71.5,57.36) v1(72.01,50.38) v1(72.01,49.61) v1(72.01,48.85) v1(72.01,48.09) v1(72.14,71.33) v1(72.14,70.57) v1(72.14,69.81) v1(72.14,69.05) v1(72.26,59.65) v1(72.26,58.89) v1(72.26,58.12) v1(72.26,57.36) v1(72.39,35.64) v1(72.39,34.88) v1(72.39,34.12) v1(72.39,33.36) v1(72.9,71.33) v1(72.9,70.57) v1(72.9,69.81) v1(72.9,69.05) v1(73.15,35.64) v1(73.15,34.88) v1(73.15,34.12) v1(73.15,33.36) v1(73.66,71.33) v1(73.66,70.57) v1(73.66,69.81) v1(73.66,69.05) v1(73.91,35.64) v1(73.91,34.88) v1(73.91,34.12) v1(73.91,33.36) v1(74.68,35.64) v1(74.68,34.88) v1(74.68,34.12) v1(74.68,33.36) v1(79.88,21.8) v1(79.88,21.04) v1(80.64,21.8) v1(80.65,21.04) v1(81.41,71.08) v1(81.41,70.31) v1(81.41,69.55) v1(81.41,68.79) v1(82.17,71.08) v1(82.17,70.31) v1(82.17,69.55) v1(82.17,68.79) v1(82.93,71.08) v1(82.93,70.31) v1(82.93,69.55) v1(82.93,68.79) v1(83.57,17.86) v1(83.57,17.1) v1(83.69,71.08) v1(83.69,70.31) v1(83.69,69.55) v1(83.69,68.79) v1(84.33,17.86) v1(84.33,17.1) v1(84.46,38.56) v1(84.46,37.8) v1(84.45,37.04) v1(84.45,36.28) v1(85.22,38.56) v1(85.22,37.8) v1(85.22,37.04) v1(85.22,36.28) v1(85.98,38.56) v1(85.98,37.8) v1(85.98,37.04) v1(85.98,36.28) v1(86.74,60.79) v1(86.74,60.03) v1(86.74,59.27) v1(86.74,58.5) v1(86.74,38.56) v1(86.74,37.8) v1(86.74,37.04) v1(86.74,36.28) v1(87.5,60.79) v1(87.5,60.03) v1(87.5,59.27) v1(87.5,58.5) v1(88.01,49.36) v1(88.01,48.6) v1(88.01,47.84) v1(88.01,47.07) v1(88.26,60.79) v1(88.26,60.03) v1(88.26,59.27) v1(88.26,58.5) v1(88.77,49.36) v1(88.77,48.6) v1(88.77,47.84) v1(88.77,47.07) v1(89.03,60.79) v1(89.03,60.03) v1(89.03,59.27) v1(89.03,58.5) v1(89.53,49.36) v1(89.53,48.6) v1(89.53,47.84) v1(89.53,47.07) v1(90.3,49.36) v1(90.3,48.6) v1(90.3,47.84) v1(90.3,47.07)
ADC1: length 58.9
  Top Layer w0.508: R1.1 86.61,73.63 R2.2 66.04,73.62 42.54,50.12
BUZZER_IO: length 37.7
  Top Layer w0.508: 24.77,50.12 24.77,80.86 蜂鸣器.2
DC01_RX: length 41.5
  Top Layer w0.508: U1.35 5.09,64.72 DC01.3
DC01_TX: length 41
  Top Layer w0.508: DC01.4 3.59,63.67 17.14,50.12
DHT11_DATA: length 19.9
  Top Layer w0.508: DHT11.2 22.22,66.63 22.22,50.12
ESP_RX: length 74.5
  Top Layer w0.508: U1.6 31.37,23.2 71.88,23.2 esp8266.4
ESP_TX: length 78.5
  Top Layer w0.508: 22.22,34.88 31.62,25.48 79.76,25.48 esp8266.5
I2C1_SCL: length 49.2
  Top Layer w0.508: OLED1.3 72.77,43.01 48.13,43.01 U1.14
I2C1_SDA: length 49.2
  Top Layer w0.508: OLED1.4 72.9,40.6 48.26,40.6 42.54,34.88
LIGHT_ADDR: length 42.4
  Top Layer w0.508: 48.64,85.81 32.38,69.55 32.38,50.12
LIGHT_SCL: length 42.4
  Top Layer w0.508: U1.32 27.31,69.55 光强度光照度模块.3
LIGHT_SDA: length 42.4
  Top Layer w0.508: 光强度光照度模块.4 29.84,69.55 U1.31
SMOKE_DO: length 68
  Top Layer w0.508: U1.25 62.36,67.39 86.87,67.39 89.12,69.64 烟雾传感器.3
SW1: length 26.8
  Top Layer w0.508: SW1.2 SW1.1 6.98,17.01 6.98,34.88
SW2: length 31.4
  Top Layer w0.508: SW2.2 SW2.1 22.32,22.09 U1.2
SW3: length 41.9
  Top Layer w0.508: SW3.2 SW3.1 31.66,15.29 12.06,34.88
SW4: length 56.5
  Top Layer w0.508: SW4.2 SW4.1 50.94,20.78 28.7,20.78 U1.4
USART2_RX: length 47.7
  Top Layer w0.508: zigbee.2 37.47,55.96 U1.28
USART2_TX: length 47.7
  Top Layer w0.508: zigbee.3 40,55.96 U1.27
$1N46: length 4.8
  Top Layer w0.508: 烟雾传感器.4 86.58,80.75 R1.2

## Copper pours and planes (outline as drawn; the poured copper is in the pictures)
GND on Top Layer: -11.81,100.29 133.48,100.29 133.48,-10.97 -11.81,-10.97
GND on Bottom Layer: -6.22,95.33 113.16,95.33 113.16,-7.54 -6.22,-7.54

Small or netless copper shapes (teardrops, artwork), in the pictures only: 52 on Top Layer, 15 on Bottom Layer
